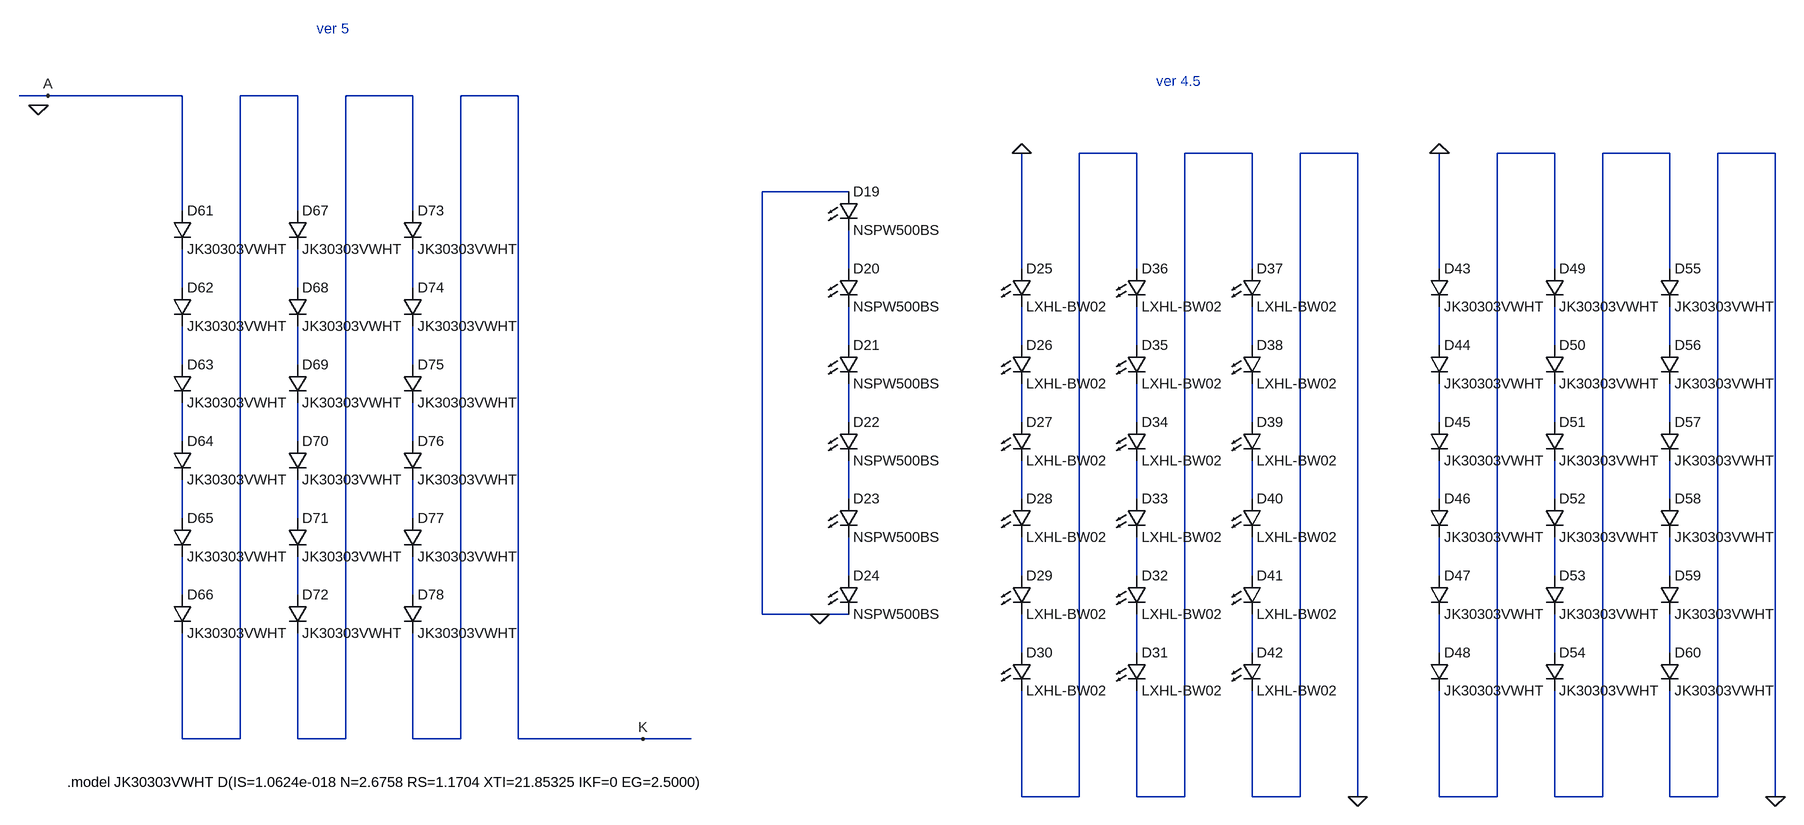
[diagram p0: schematic LED_strip - old.asc]
LED_strip - old.asc, the LTspice schematic file:
Version 4.1
SHEET 1 4488 1172
WIRE 16 -16 -32 -16
WIRE 240 -16 16 -16
WIRE 432 -16 336 -16
WIRE 624 -16 512 -16
WIRE 800 -16 704 -16
WIRE 2384 80 2288 80
WIRE 2576 80 2464 80
WIRE 2752 80 2656 80
WIRE 3152 80 3056 80
WIRE 3344 80 3232 80
WIRE 3520 80 3424 80
WIRE 1552 144 1408 144
WIRE 240 176 240 -16
WIRE 432 176 432 -16
WIRE 624 176 624 -16
WIRE 1552 272 1552 208
WIRE 2192 272 2192 80
WIRE 2384 272 2384 80
WIRE 2576 272 2576 80
WIRE 2960 272 2960 80
WIRE 3152 272 3152 80
WIRE 3344 272 3344 80
WIRE 240 304 240 240
WIRE 432 304 432 240
WIRE 624 304 624 240
WIRE 1552 400 1552 336
WIRE 2192 400 2192 336
WIRE 2384 400 2384 336
WIRE 2576 400 2576 336
WIRE 2960 400 2960 336
WIRE 3152 400 3152 336
WIRE 3344 400 3344 336
WIRE 240 432 240 368
WIRE 432 432 432 368
WIRE 624 432 624 368
WIRE 1552 528 1552 464
WIRE 2192 528 2192 464
WIRE 2384 528 2384 464
WIRE 2576 528 2576 464
WIRE 2960 528 2960 464
WIRE 3152 528 3152 464
WIRE 3344 528 3344 464
WIRE 240 560 240 496
WIRE 432 560 432 496
WIRE 624 560 624 496
WIRE 1552 656 1552 592
WIRE 2192 656 2192 592
WIRE 2384 656 2384 592
WIRE 2576 656 2576 592
WIRE 2960 656 2960 592
WIRE 3152 656 3152 592
WIRE 3344 656 3344 592
WIRE 240 688 240 624
WIRE 432 688 432 624
WIRE 624 688 624 624
WIRE 1552 784 1552 720
WIRE 2192 784 2192 720
WIRE 2384 784 2384 720
WIRE 2576 784 2576 720
WIRE 2960 784 2960 720
WIRE 3152 784 3152 720
WIRE 3344 784 3344 720
WIRE 240 816 240 752
WIRE 432 816 432 752
WIRE 624 816 624 752
WIRE 1408 848 1408 144
WIRE 1504 848 1408 848
WIRE 1552 848 1504 848
WIRE 2192 912 2192 848
WIRE 2384 912 2384 848
WIRE 2576 912 2576 848
WIRE 2960 912 2960 848
WIRE 3152 912 3152 848
WIRE 3344 912 3344 848
WIRE 240 1056 240 880
WIRE 336 1056 336 -16
WIRE 336 1056 240 1056
WIRE 432 1056 432 880
WIRE 512 1056 512 -16
WIRE 512 1056 432 1056
WIRE 624 1056 624 880
WIRE 704 1056 704 -16
WIRE 704 1056 624 1056
WIRE 800 1056 800 -16
WIRE 1008 1056 800 1056
WIRE 1088 1056 1008 1056
WIRE 2192 1152 2192 976
WIRE 2288 1152 2288 80
WIRE 2288 1152 2192 1152
WIRE 2384 1152 2384 976
WIRE 2464 1152 2464 80
WIRE 2464 1152 2384 1152
WIRE 2576 1152 2576 976
WIRE 2656 1152 2656 80
WIRE 2656 1152 2576 1152
WIRE 2752 1152 2752 80
WIRE 2960 1152 2960 976
WIRE 3056 1152 3056 80
WIRE 3056 1152 2960 1152
WIRE 3152 1152 3152 976
WIRE 3232 1152 3232 80
WIRE 3232 1152 3152 1152
WIRE 3344 1152 3344 976
WIRE 3424 1152 3424 80
WIRE 3424 1152 3344 1152
WIRE 3520 1152 3520 80
FLAG 16 -16 A
FLAG 1008 1056 K
FLAG 1504 848 0
FLAG 2192 80 0
FLAG 2752 1152 0
FLAG 3520 1152 0
FLAG 2960 80 0
FLAG 0 0 0
SYMBOL LED 1536 144 R0
SYMATTR InstName D19
SYMATTR Value NSPW500BS
SYMBOL LED 1536 272 R0
SYMATTR InstName D20
SYMATTR Value NSPW500BS
SYMBOL LED 1536 400 R0
SYMATTR InstName D21
SYMATTR Value NSPW500BS
SYMBOL LED 1536 528 R0
SYMATTR InstName D22
SYMATTR Value NSPW500BS
SYMBOL LED 1536 656 R0
SYMATTR InstName D23
SYMATTR Value NSPW500BS
SYMBOL LED 1536 784 R0
SYMATTR InstName D24
SYMATTR Value NSPW500BS
SYMBOL LED 2176 272 R0
SYMATTR InstName D25
SYMATTR Value LXHL-BW02
SYMBOL LED 2176 400 R0
SYMATTR InstName D26
SYMATTR Value LXHL-BW02
SYMBOL LED 2176 528 R0
SYMATTR InstName D27
SYMATTR Value LXHL-BW02
SYMBOL LED 2176 656 R0
SYMATTR InstName D28
SYMATTR Value LXHL-BW02
SYMBOL LED 2176 784 R0
SYMATTR InstName D29
SYMATTR Value LXHL-BW02
SYMBOL LED 2176 912 R0
SYMATTR InstName D30
SYMATTR Value LXHL-BW02
SYMBOL LED 2368 912 R0
SYMATTR InstName D31
SYMATTR Value LXHL-BW02
SYMBOL LED 2368 784 R0
SYMATTR InstName D32
SYMATTR Value LXHL-BW02
SYMBOL LED 2368 656 R0
SYMATTR InstName D33
SYMATTR Value LXHL-BW02
SYMBOL LED 2368 528 R0
SYMATTR InstName D34
SYMATTR Value LXHL-BW02
SYMBOL LED 2368 400 R0
SYMATTR InstName D35
SYMATTR Value LXHL-BW02
SYMBOL LED 2368 272 R0
SYMATTR InstName D36
SYMATTR Value LXHL-BW02
SYMBOL LED 2560 272 R0
SYMATTR InstName D37
SYMATTR Value LXHL-BW02
SYMBOL LED 2560 400 R0
SYMATTR InstName D38
SYMATTR Value LXHL-BW02
SYMBOL LED 2560 528 R0
SYMATTR InstName D39
SYMATTR Value LXHL-BW02
SYMBOL LED 2560 656 R0
SYMATTR InstName D40
SYMATTR Value LXHL-BW02
SYMBOL LED 2560 784 R0
SYMATTR InstName D41
SYMATTR Value LXHL-BW02
SYMBOL LED 2560 912 R0
SYMATTR InstName D42
SYMATTR Value LXHL-BW02
SYMBOL diode 2944 272 R0
SYMATTR InstName D43
SYMATTR Value JK30303VWHT
SYMBOL diode 2944 400 R0
SYMATTR InstName D44
SYMATTR Value JK30303VWHT
SYMBOL diode 2944 528 R0
SYMATTR InstName D45
SYMATTR Value JK30303VWHT
SYMBOL diode 2944 656 R0
SYMATTR InstName D46
SYMATTR Value JK30303VWHT
SYMBOL diode 2944 784 R0
SYMATTR InstName D47
SYMATTR Value JK30303VWHT
SYMBOL diode 2944 912 R0
SYMATTR InstName D48
SYMATTR Value JK30303VWHT
SYMBOL diode 3136 272 R0
SYMATTR InstName D49
SYMATTR Value JK30303VWHT
SYMBOL diode 3136 400 R0
SYMATTR InstName D50
SYMATTR Value JK30303VWHT
SYMBOL diode 3136 528 R0
SYMATTR InstName D51
SYMATTR Value JK30303VWHT
SYMBOL diode 3136 656 R0
SYMATTR InstName D52
SYMATTR Value JK30303VWHT
SYMBOL diode 3136 784 R0
SYMATTR InstName D53
SYMATTR Value JK30303VWHT
SYMBOL diode 3136 912 R0
SYMATTR InstName D54
SYMATTR Value JK30303VWHT
SYMBOL diode 3328 272 R0
SYMATTR InstName D55
SYMATTR Value JK30303VWHT
SYMBOL diode 3328 400 R0
SYMATTR InstName D56
SYMATTR Value JK30303VWHT
SYMBOL diode 3328 528 R0
SYMATTR InstName D57
SYMATTR Value JK30303VWHT
SYMBOL diode 3328 656 R0
SYMATTR InstName D58
SYMATTR Value JK30303VWHT
SYMBOL diode 3328 784 R0
SYMATTR InstName D59
SYMATTR Value JK30303VWHT
SYMBOL diode 3328 912 R0
SYMATTR InstName D60
SYMATTR Value JK30303VWHT
SYMBOL diode 224 176 R0
SYMATTR InstName D61
SYMATTR Value JK30303VWHT
SYMBOL diode 224 304 R0
SYMATTR InstName D62
SYMATTR Value JK30303VWHT
SYMBOL diode 224 432 R0
SYMATTR InstName D63
SYMATTR Value JK30303VWHT
SYMBOL diode 224 560 R0
SYMATTR InstName D64
SYMATTR Value JK30303VWHT
SYMBOL diode 224 688 R0
SYMATTR InstName D65
SYMATTR Value JK30303VWHT
SYMBOL diode 224 816 R0
SYMATTR InstName D66
SYMATTR Value JK30303VWHT
SYMBOL diode 416 176 R0
SYMATTR InstName D67
SYMATTR Value JK30303VWHT
SYMBOL diode 416 304 R0
SYMATTR InstName D68
SYMATTR Value JK30303VWHT
SYMBOL diode 416 432 R0
SYMATTR InstName D69
SYMATTR Value JK30303VWHT
SYMBOL diode 416 560 R0
SYMATTR InstName D70
SYMATTR Value JK30303VWHT
SYMBOL diode 416 688 R0
SYMATTR InstName D71
SYMATTR Value JK30303VWHT
SYMBOL diode 416 816 R0
SYMATTR InstName D72
SYMATTR Value JK30303VWHT
SYMBOL diode 608 176 R0
SYMATTR InstName D73
SYMATTR Value JK30303VWHT
SYMBOL diode 608 304 R0
SYMATTR InstName D74
SYMATTR Value JK30303VWHT
SYMBOL diode 608 432 R0
SYMATTR InstName D75
SYMATTR Value JK30303VWHT
SYMBOL diode 608 560 R0
SYMATTR InstName D76
SYMATTR Value JK30303VWHT
SYMBOL diode 608 688 R0
SYMATTR InstName D77
SYMATTR Value JK30303VWHT
SYMBOL diode 608 816 R0
SYMATTR InstName D78
SYMATTR Value JK30303VWHT
TEXT 2416 -40 Left 2 ;ver 4.5
TEXT 48 1128 Left 2 !.model JK30303VWHT D(IS=1.0624e-018 N=2.6758 RS=1.1704 XTI=21.85325 IKF=0 EG=2.5000)
TEXT 464 -128 Left 2 ;ver 5

The netlist it stands for:
* LED_strip - old.asc
D19 0 N007 NSPW500BS
D20 N007 N011 NSPW500BS
D21 N011 N021 NSPW500BS
D22 N021 N031 NSPW500BS
D23 N031 N041 NSPW500BS
D24 N041 0 NSPW500BS
D25 0 N012 LXHL-BW02
D26 N012 N022 LXHL-BW02
D27 N022 N032 LXHL-BW02
D28 N032 N042 LXHL-BW02
D29 N042 N051 LXHL-BW02
D30 N051 N003 LXHL-BW02
D31 N052 N004 LXHL-BW02
D32 N043 N052 LXHL-BW02
D33 N033 N043 LXHL-BW02
D34 N023 N033 LXHL-BW02
D35 N013 N023 LXHL-BW02
D36 N003 N013 LXHL-BW02
D37 N004 N014 LXHL-BW02
D38 N014 N024 LXHL-BW02
D39 N024 N034 LXHL-BW02
D40 N034 N044 LXHL-BW02
D41 N044 N053 LXHL-BW02
D42 N053 0 LXHL-BW02
D43 0 N015 JK30303VWHT
D44 N015 N025 JK30303VWHT
D45 N025 N035 JK30303VWHT
D46 N035 N045 JK30303VWHT
D47 N045 N054 JK30303VWHT
D48 N054 N005 JK30303VWHT
D49 N005 N016 JK30303VWHT
D50 N016 N026 JK30303VWHT
D51 N026 N036 JK30303VWHT
D52 N036 N046 JK30303VWHT
D53 N046 N055 JK30303VWHT
D54 N055 N006 JK30303VWHT
D55 N006 N017 JK30303VWHT
D56 N017 N027 JK30303VWHT
D57 N027 N037 JK30303VWHT
D58 N037 N047 JK30303VWHT
D59 N047 N056 JK30303VWHT
D60 N056 0 JK30303VWHT
D61 A N008 JK30303VWHT
D62 N008 N018 JK30303VWHT
D63 N018 N028 JK30303VWHT
D64 N028 N038 JK30303VWHT
D65 N038 N048 JK30303VWHT
D66 N048 N001 JK30303VWHT
D67 N001 N009 JK30303VWHT
D68 N009 N019 JK30303VWHT
D69 N019 N029 JK30303VWHT
D70 N029 N039 JK30303VWHT
D71 N039 N049 JK30303VWHT
D72 N049 N002 JK30303VWHT
D73 N002 N010 JK30303VWHT
D74 N010 N020 JK30303VWHT
D75 N020 N030 JK30303VWHT
D76 N030 N040 JK30303VWHT
D77 N040 N050 JK30303VWHT
D78 N050 K JK30303VWHT
.model D D
.lib standard.dio
* ver 4.5
.model JK30303VWHT D(IS=1.0624e-018 N=2.6758 RS=1.1704 XTI=21.85325 IKF=0 EG=2.5000)
* ver 5
.backanno
.end